# Altium schematic sheet Driver.SchDoc
size A4; SheetNumber: 6; SheetTotal: 7
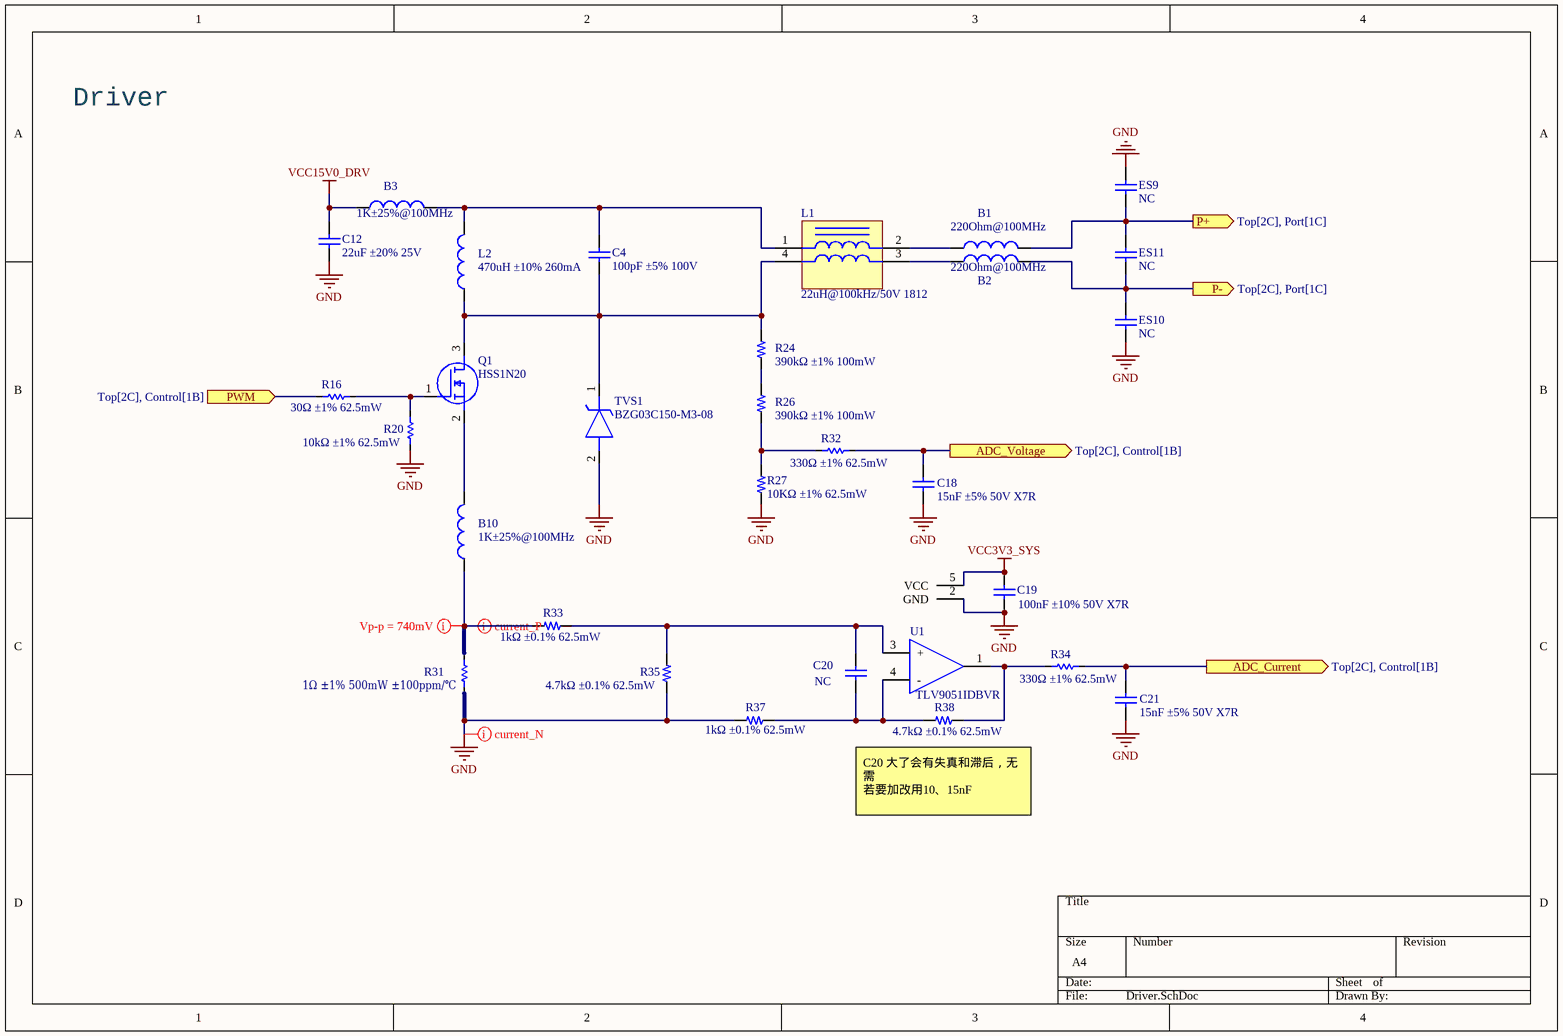
[diagram p0: Driver.SchDoc]

## Parts
B1  220Ohm@100MHz  [0402-B]
B2  220Ohm@100MHz  [0402-B]
B3  1K±25%@100MHz  [0805-B]
B10  1K±25%@100MHz  [0805-B]
C4  100pF ±5% 100V  [C0603]
C12  22uF ±20% 25V  [C0805]
C18  15nF ±5% 50V X7R  [C0402]
C19  100nF ±10% 50V X7R  [C0402]
C20  NC  [C0402]
C21  15nF ±5% 50V X7R  [C0402]
ES9  NC  [C0402]
ES10  NC  [C0402]
ES11  NC  [C0402]
L1  22uH@100kHz/50V 1812  [LINEFILTER]
L2  470uH ±10% 260mA  [SP0502]
Q1  HSS1N20  [SOT95P237X122-3N]
R16  30Ω ±1% 62.5mW  [R0402]
R20  10kΩ ±1% 62.5mW  [R0402]
R24  390kΩ ±1% 100mW  [R0603]
R26  390kΩ ±1% 100mW  [R0603]
R27  10KΩ ±1% 62.5mW  [R0402]
R31  1Ω ±1% 500mW ±100ppm/℃  [R1206]
R32  330Ω ±1% 62.5mW  [R0402]
R33  1kΩ ±0.1% 62.5mW  [R0402]
R34  330Ω ±1% 62.5mW  [R0402]
R35  4.7kΩ ±0.1% 62.5mW  [R0402]
R37  1kΩ ±0.1% 62.5mW  [R0402]
R38  4.7kΩ ±0.1% 62.5mW  [R0402]
TVS1  BZG03C150-M3-08  [DIOM5226X230N]
U1  TLV9051IDBVR  [SOT23-5]

## Ports
ADC_Current (out, see Top[2C], Control[1B]), ADC_Voltage (out, see Top[2C], Control[1B]), P+ (out, see Top[2C], Port[1C]), P- (out, see Top[2C], Port[1C]), PWM (in, see Top[2C], Control[1B])

## Nets
GND: C12.1 C18.2 C19.1 C21.2 ES9.1 ES10.2 R20.1 R27.2 R31.1 R35.1 R37.1 TVS1.2(A) U1.2(GND)
VCC3V3_SYS: C19.2 U1.5(VCC)
VCC15V0_DRV: B3.1 C12.2
ADC_Current: C21.1 R34.2 ; port ADC_Current
ADC_Voltage: C18.1 R32.2 ; port ADC_Voltage
P+: B1.2 ES9.2 ES11.1 ; port P+
P-: B2.2 ES10.1 ES11.2 ; port P-
PWM: R16.1 ; port PWM
NetB1_1: B1.1 L1.2
NetB2_1: B2.1 L1.3
NetB3_2: B3.2 C4.1 L1.1 L2.2
NetB10_1: B10.1 R31.2 R33.1
NetB10_2: B10.2 Q1.2(S)
NetC4_2: C4.2 L1.4 L2.1 Q1.3(D) R24.1 TVS1.1(K)
NetC20_1: C20.1 R37.2 R38.2 U1.4(-)
NetC20_2: C20.2 R33.2 R35.2 U1.3(+)
NetQ1_1: Q1.1(G) R16.2 R20.2
NetR24_2: R24.2 R26.1
NetR26_2: R26.2 R27.1 R32.1
NetR34_1: R34.1 R38.1 U1.1

## Layout directives
mark named Vp-p = 740mV: NetB10_1
differential pair: GND, NetB10_1

## Notes on the sheet
- Driver
- Power NMOS
  Alternative:
  HSS1N20
  G01N20LE
  G2003A
- (near R38) 差分放大电路
  化简为:
  Vout = (R2 / R1) (Vr - Vgnd)
- (near R38) C20 大了会有失真和滞后，无需
  若要加改用10、15nF

## Library data of the parts
B1 B2 = Inductor: BLM15AG221SN1D; Code_IEC: 1005; Value: 10uH; Published: 8-Jun-2000; LatestRevisionDate: 29-May-2009; LatestRevisionNote: IPC-7351 Footprint Added.; PackageReference: 0402-A; Publisher: Altium Limited; PackageDescription: Chip Inductor; Code_JEITA: 0402
B3 B10 = Inductor: BLM21AG102SN1D; Code_IEC: 1005; Value: 10uH; Published: 8-Jun-2000; LatestRevisionDate: 29-May-2009; LatestRevisionNote: IPC-7351 Footprint Added.; PackageReference: 0402-A; Publisher: Altium Limited; PackageDescription: Chip Inductor; Code_JEITA: 0402
C4 = Cap Semi: GCM1885C2A101JA16D; Published: 8-Jun-2000; LatestRevisionDate: 29-May-2009; LatestRevisionNote: IPC-7351 Footprint Added.; PackageReference: C1206; Publisher: Altium Limited; PackageDescription: Chip Capacitor; Value: 100pF
C12 = C0805: CL21A226MAQNNNE; Published: 8-Jun-2000; LatestRevisionDate: 17-Jul-2002; LatestRevisionNote: Re-released for DXP Platform.; PackageReference: RAD-0.3; Publisher: Altium Limited; PackageDescription: Radial Cap, Thru-Hole; 2 Leads; 0.3 in Pin Spacing
C18 C21 = Cap: CC0402KRX7R9BB153; Published: 8-Jun-2000; LatestRevisionDate: 17-Jul-2002; LatestRevisionNote: Re-released for DXP Platform.; PackageReference: RAD-0.3; Publisher: Altium Limited; PackageDescription: Radial Cap, Thru-Hole; 2 Leads; 0.3 in Pin Spacing
C19 = Cap: CL05B104KO5NNNC; Published: 8-Jun-2000; LatestRevisionDate: 17-Jul-2002; LatestRevisionNote: Re-released for DXP Platform.; PackageReference: RAD-0.3; Publisher: Altium Limited; PackageDescription: Radial Cap, Thru-Hole; 2 Leads; 0.3 in Pin Spacing
C20 = 100nF_1: 10nF 50V 0402; 物料编号: 210001894; 详细描述: X7R,50V,三星CL21B104JBCNNNC; 版本: V1.00; 名称: 贴片瓷介电容100nF±5%,0805; 制造商: 三星
ES9-ES11 = Cap Semi: Capacitor (Semiconductor SIM Model); Value: 100pF; Published: 8-Jun-2000; LatestRevisionDate: 29-May-2009; LatestRevisionNote: IPC-7351 Footprint Added.; PackageReference: C1206; Publisher: Altium Limited; PackageDescription: Chip Capacitor
L1 = Inductor_common: APWB4532-220T2
L2 = Inductor: SDR0603-471KL; Code_IEC: 1005; Value: 10uH; Published: 8-Jun-2000; LatestRevisionDate: 29-May-2009; LatestRevisionNote: IPC-7351 Footprint Added.; PackageReference: 0402-A; Publisher: Altium Limited; PackageDescription: Chip Inductor; Code_JEITA: 0402
Q1 = FDN86246: MOSFET (N-Channel); Manufacturer_Name: onsemi; Datasheet Link: https://www.onsemi.com/pub/Collateral/FDN86246-D.pdf; Height: 1.22mm; Manufacturer_Part_Number: FDN86246; Mouser Part Number: 512-FDN86246; Mouser Price/Stock: https://www.mouser.co.uk/ProductDetail/onsemi-Fairchild/FDN86246?qs=dIxESgyDOrhoaLoGKHFSzg%3D%3D; Arrow Part Number: FDN86246; Arrow Price/Stock: https://www.arrow.com/en/products/fdn86246/on-semiconductor?region=nac
R16 = R0402: RC0402FR-0730RL; Published: 8-Jun-2000; LatestRevisionDate: 17-Jul-2002; LatestRevisionNote: Re-released for DXP Platform.; PackageReference: AXIAL-0.3; Publisher: Altium Limited; PackageDescription: Axial Device, Thru-Hole; 2 Leads; 0.3 in Pin Spacing
R20 = R0402: 0402WGF1002TCE; Published: 8-Jun-2000; LatestRevisionDate: 17-Jul-2002; LatestRevisionNote: Re-released for DXP Platform.; PackageReference: AXIAL-0.3; Publisher: Altium Limited; PackageDescription: Axial Device, Thru-Hole; 2 Leads; 0.3 in Pin Spacing
R24 R26 = R-0603: RC0603FR-07390KL
R27 = R-0603: 0402WGF1002TCE
R31 = R1206: HP06W2F100KT5E; Published: 8-Jun-2000; LatestRevisionDate: 17-Jul-2002; LatestRevisionNote: Re-released for DXP Platform.; PackageReference: AXIAL-0.3; Publisher: Altium Limited; PackageDescription: Axial Device, Thru-Hole; 2 Leads; 0.3 in Pin Spacing
R32 R34 = R0402: 0402WGF3300TCE; Published: 8-Jun-2000; LatestRevisionDate: 17-Jul-2002; LatestRevisionNote: Re-released for DXP Platform.; PackageReference: AXIAL-0.3; Publisher: Altium Limited; PackageDescription: Axial Device, Thru-Hole; 2 Leads; 0.3 in Pin Spacing
R33 R37 = R-0603: RT0402BRD071KL
R35 R38 = R-0603: RT0402BRD074K7L
TVS1 = BZG03C150-M3-08: Zener Diode / BZG03C150-M3-08; Manufacturer_Name: Vishay; Datasheet Link: http://www.vishay.com/docs/86138/bzg03c-m-series.pdf; Height: 2.3mm; Manufacturer_Part_Number: BZG03C150-M3-08; Mouser Part Number: 78-BZG03C150-M3-08; Mouser Price/Stock: https://www.mouser.co.uk/ProductDetail/Vishay-Semiconductors/BZG03C150-M3-08?qs=j%252B1pi9TdxUabEYlfZgnvtQ%3D%3D; Arrow Part Number: BZG03C150-M3-08; Arrow Price/Stock: https://www.arrow.com/en/products/bzg03c150-m3-08/vishay
U1 = TLV333IDBVR: TLV9051 适用于成本优化型应用的单路、5.5V、5MHz、15V/μs 压摆率、RRIO 运算放大器